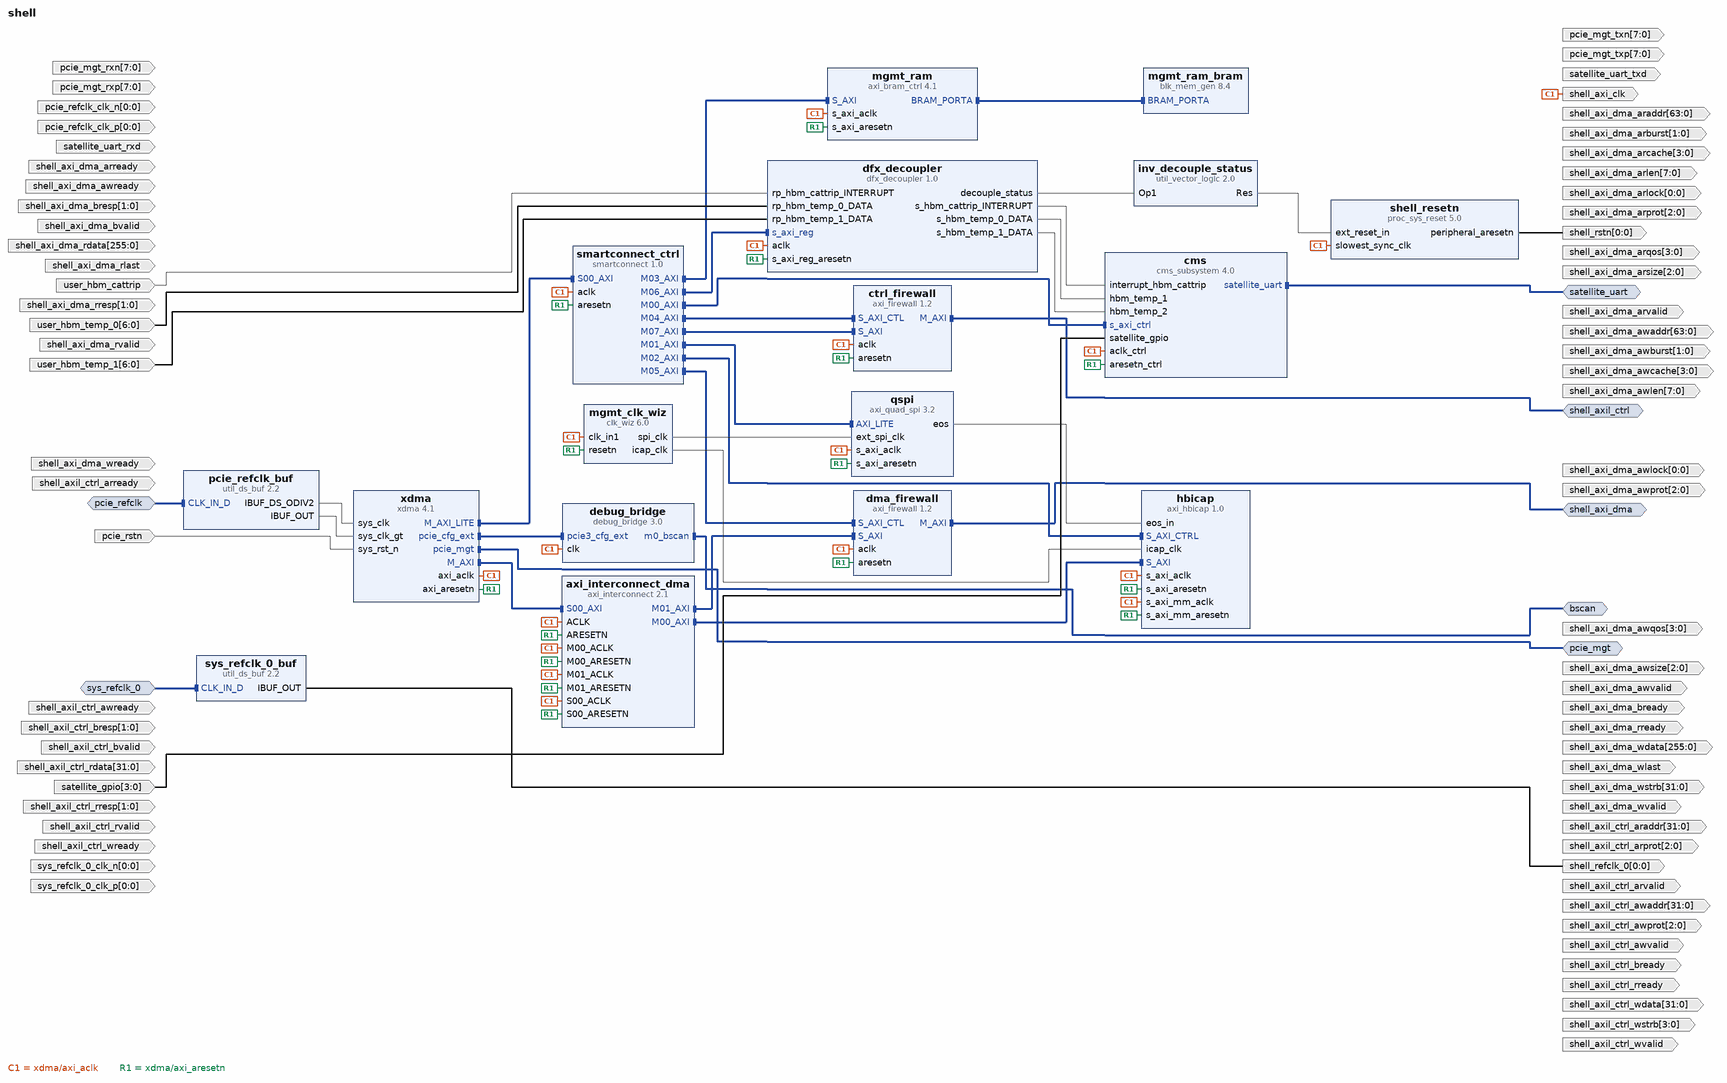
[diagram p0: block diagram of the top level]
# Vivado block design shell, xcu55n-fsvh2892-2L-e, Vivado 2022.2
create_bd_design shell

create_bd_intf_port -mode Master -vlnv xilinx.com:interface:pcie_7x_mgt_rtl:1.0 pcie_mgt
create_bd_intf_port -mode Slave -vlnv xilinx.com:interface:diff_clock_rtl:1.0 pcie_refclk
create_bd_intf_port -mode Master -vlnv xilinx.com:interface:uart_rtl:1.0 satellite_uart
create_bd_intf_port -mode Master -vlnv xilinx.com:interface:aximm_rtl:1.0 shell_axi_dma
set_property -dict [list \
  CONFIG.ADDR_WIDTH 64 \
  CONFIG.DATA_WIDTH 256 \
  CONFIG.HAS_QOS 1 \
  CONFIG.HAS_REGION 0 \
  CONFIG.NUM_READ_OUTSTANDING 32 \
  CONFIG.NUM_WRITE_OUTSTANDING 16 \
  CONFIG.PROTOCOL AXI4 \
] [get_bd_intf_ports shell_axi_dma]
create_bd_intf_port -mode Master -vlnv xilinx.com:interface:aximm_rtl:1.0 shell_axil_ctrl
set_property -dict [list \
  CONFIG.ADDR_WIDTH 32 \
  CONFIG.DATA_WIDTH 32 \
  CONFIG.HAS_BRESP 1 \
  CONFIG.HAS_BURST 0 \
  CONFIG.HAS_CACHE 0 \
  CONFIG.HAS_LOCK 0 \
  CONFIG.HAS_PROT 1 \
  CONFIG.HAS_QOS 0 \
  CONFIG.HAS_REGION 0 \
  CONFIG.HAS_RRESP 1 \
  CONFIG.PROTOCOL AXI4LITE \
] [get_bd_intf_ports shell_axil_ctrl]
create_bd_intf_port -mode Slave -vlnv xilinx.com:interface:diff_clock_rtl:1.0 sys_refclk_0
create_bd_intf_port -mode Master -vlnv xilinx.com:interface:bscan_rtl:1.0 bscan
create_bd_port -dir I -from 7 -to 0 pcie_mgt_rxn
create_bd_port -dir I -from 7 -to 0 pcie_mgt_rxp
create_bd_port -dir O -from 7 -to 0 pcie_mgt_txn
create_bd_port -dir O -from 7 -to 0 pcie_mgt_txp
create_bd_port -dir I -from 0 -to 0 pcie_refclk_clk_p
create_bd_port -dir I -from 0 -to 0 pcie_refclk_clk_n
create_bd_port -dir I satellite_uart_rxd
create_bd_port -dir O satellite_uart_txd
create_bd_port -dir O -from 63 -to 0 shell_axi_dma_araddr
create_bd_port -dir O -from 1 -to 0 shell_axi_dma_arburst
create_bd_port -dir O -from 3 -to 0 shell_axi_dma_arcache
create_bd_port -dir O -from 7 -to 0 shell_axi_dma_arlen
create_bd_port -dir O -from 0 -to 0 shell_axi_dma_arlock
create_bd_port -dir O -from 2 -to 0 shell_axi_dma_arprot
create_bd_port -dir O -from 3 -to 0 shell_axi_dma_arqos
create_bd_port -dir I shell_axi_dma_arready
create_bd_port -dir O -from 2 -to 0 shell_axi_dma_arsize
create_bd_port -dir O shell_axi_dma_arvalid
create_bd_port -dir O -from 63 -to 0 shell_axi_dma_awaddr
create_bd_port -dir O -from 1 -to 0 shell_axi_dma_awburst
create_bd_port -dir O -from 3 -to 0 shell_axi_dma_awcache
create_bd_port -dir O -from 7 -to 0 shell_axi_dma_awlen
create_bd_port -dir O -from 0 -to 0 shell_axi_dma_awlock
create_bd_port -dir O -from 2 -to 0 shell_axi_dma_awprot
create_bd_port -dir O -from 3 -to 0 shell_axi_dma_awqos
create_bd_port -dir I shell_axi_dma_awready
create_bd_port -dir O -from 2 -to 0 shell_axi_dma_awsize
create_bd_port -dir O shell_axi_dma_awvalid
create_bd_port -dir O shell_axi_dma_bready
create_bd_port -dir I -from 1 -to 0 shell_axi_dma_bresp
create_bd_port -dir I shell_axi_dma_bvalid
create_bd_port -dir I -from 255 -to 0 shell_axi_dma_rdata
create_bd_port -dir I shell_axi_dma_rlast
create_bd_port -dir O shell_axi_dma_rready
create_bd_port -dir I -from 1 -to 0 shell_axi_dma_rresp
create_bd_port -dir I shell_axi_dma_rvalid
create_bd_port -dir O -from 255 -to 0 shell_axi_dma_wdata
create_bd_port -dir O shell_axi_dma_wlast
create_bd_port -dir I shell_axi_dma_wready
create_bd_port -dir O -from 31 -to 0 shell_axi_dma_wstrb
create_bd_port -dir O shell_axi_dma_wvalid
create_bd_port -dir O -from 31 -to 0 shell_axil_ctrl_araddr
create_bd_port -dir O -from 2 -to 0 shell_axil_ctrl_arprot
create_bd_port -dir I shell_axil_ctrl_arready
create_bd_port -dir O shell_axil_ctrl_arvalid
create_bd_port -dir O -from 31 -to 0 shell_axil_ctrl_awaddr
create_bd_port -dir O -from 2 -to 0 shell_axil_ctrl_awprot
create_bd_port -dir I shell_axil_ctrl_awready
create_bd_port -dir O shell_axil_ctrl_awvalid
create_bd_port -dir O shell_axil_ctrl_bready
create_bd_port -dir I -from 1 -to 0 shell_axil_ctrl_bresp
create_bd_port -dir I shell_axil_ctrl_bvalid
create_bd_port -dir I -from 31 -to 0 shell_axil_ctrl_rdata
create_bd_port -dir O shell_axil_ctrl_rready
create_bd_port -dir I -from 1 -to 0 shell_axil_ctrl_rresp
create_bd_port -dir I shell_axil_ctrl_rvalid
create_bd_port -dir O -from 31 -to 0 shell_axil_ctrl_wdata
create_bd_port -dir I shell_axil_ctrl_wready
create_bd_port -dir O -from 3 -to 0 shell_axil_ctrl_wstrb
create_bd_port -dir O shell_axil_ctrl_wvalid
create_bd_port -dir I -from 0 -to 0 sys_refclk_0_clk_p
create_bd_port -dir I -from 0 -to 0 sys_refclk_0_clk_n
create_bd_port -dir I -type rst pcie_rstn
create_bd_port -dir I -from 3 -to 0 -type intr satellite_gpio
set_property -dict {CONFIG.PortWidth 4 CONFIG.SENSITIVITY EDGE_RISING} [get_bd_ports satellite_gpio]
create_bd_port -dir O -type clk shell_axi_clk
set_property -dict [list \
  CONFIG.ASSOCIATED_BUSIF shell_axi_dma:shell_axil_ctrl \
  CONFIG.ASSOCIATED_RESET shell_rstn \
] [get_bd_ports shell_axi_clk]
create_bd_port -dir O -from 0 -to 0 -type clk shell_refclk_0
create_bd_port -dir O -from 0 -to 0 -type rst shell_rstn
create_bd_port -dir I -type intr user_hbm_cattrip
create_bd_port -dir I -from 6 -to 0 user_hbm_temp_0
create_bd_port -dir I -from 6 -to 0 user_hbm_temp_1

create_bd_cell -type ip -vlnv xilinx.com:ip:cms_subsystem:4.0 cms
create_bd_cell -type ip -vlnv xilinx.com:ip:axi_firewall:1.2 ctrl_firewall
set_property -dict [list \
  CONFIG.ENABLE_PRESCALER 1 \
  CONFIG.ENABLE_PROTOCOL_CHECKS 1 \
  CONFIG.FIREWALL_MODE MI_SIDE \
  CONFIG.HAS_ARESETN 1 \
] [get_bd_cells ctrl_firewall]
create_bd_cell -type ip -vlnv xilinx.com:ip:debug_bridge:3.0 debug_bridge
set_property -dict {CONFIG.C_BSCAN_MUX 2 CONFIG.C_DEBUG_MODE 5 CONFIG.C_DESIGN_TYPE 0} [get_bd_cells debug_bridge]
create_bd_cell -type ip -vlnv xilinx.com:ip:dfx_decoupler:1.0 dfx_decoupler
set_property -dict [list \
  CONFIG.ALL_PARAMS {['HAS_AXI_LITE 1', 'INTF {', 'hbm_cattrip {ID 0 VLNV xilinx.com:signal:interrupt_rtl:1.0 SIGNALS {INTERRUPT {PRESENT 1 WIDTH 1}}} hbm_temp_0 {ID 1 VLNV xilinx.com:signal:data_rtl:1.0 SIGNALS {DATA {PRESENT 1 WIDTH 7}}} hbm_temp_1', '{ID 2 VLNV xilinx.com:signal:data_rtl:1.0 SIGNALS {DATA {PRESENT 1 WIDTH 7}}}', '}', 'HAS_SIGNAL_CONTROL 0', 'HAS_SIGNAL_STATUS 1', 'IPI_PROP_COUNT 0']} \
  CONFIG.GUI_INTERFACE_NAME hbm_cattrip \
  CONFIG.GUI_SELECT_VLNV xilinx.com:signal:interrupt_rtl:1.0 \
] [get_bd_cells dfx_decoupler]
create_bd_cell -type ip -vlnv xilinx.com:ip:axi_firewall:1.2 dma_firewall
set_property -dict {CONFIG.ENABLE_PRESCALER 1} [get_bd_cells dma_firewall]
create_bd_cell -type ip -vlnv xilinx.com:ip:axi_hbicap:1.0 hbicap
set_property -dict [list \
  CONFIG.C_ICAP_EXTERNAL 0 \
  CONFIG.C_INCLUDE_STARTUP 0 \
  CONFIG.C_READ_PATH 0 \
  CONFIG.C_WRITE_FIFO_DEPTH 1024 \
] [get_bd_cells hbicap]
create_bd_cell -type ip -vlnv xilinx.com:ip:util_vector_logic:2.0 inv_decouple_status
set_property -dict {CONFIG.C_OPERATION not CONFIG.C_SIZE 1} [get_bd_cells inv_decouple_status]
create_bd_cell -type ip -vlnv xilinx.com:ip:clk_wiz:6.0 mgmt_clk_wiz
set_property -dict [list \
  CONFIG.AXI_DRP false \
  CONFIG.CLKOUT1_JITTER 102.484 \
  CONFIG.CLKOUT1_PHASE_ERROR 79.008 \
  CONFIG.CLKOUT1_REQUESTED_OUT_FREQ 100 \
  CONFIG.CLKOUT2_JITTER 98.122 \
  CONFIG.CLKOUT2_PHASE_ERROR 79.008 \
  CONFIG.CLKOUT2_REQUESTED_OUT_FREQ 125 \
  CONFIG.CLKOUT2_USED true \
  CONFIG.CLK_OUT1_PORT spi_clk \
  CONFIG.CLK_OUT2_PORT icap_clk \
  CONFIG.MMCM_CLKFBOUT_MULT_F 5.000 \
  CONFIG.MMCM_CLKOUT0_DIVIDE_F 12.500 \
  CONFIG.MMCM_CLKOUT1_DIVIDE 10 \
  CONFIG.MMCM_DIVCLK_DIVIDE 1 \
  CONFIG.NUM_OUT_CLKS 2 \
  CONFIG.PHASE_DUTY_CONFIG false \
  CONFIG.RESET_PORT resetn \
  CONFIG.RESET_TYPE ACTIVE_LOW \
  CONFIG.USE_DYN_RECONFIG false \
] [get_bd_cells mgmt_clk_wiz]
create_bd_cell -type ip -vlnv xilinx.com:ip:axi_bram_ctrl:4.1 mgmt_ram
set_property -dict {CONFIG.PROTOCOL AXI4LITE CONFIG.SINGLE_PORT_BRAM 1} [get_bd_cells mgmt_ram]
create_bd_cell -type ip -vlnv xilinx.com:ip:blk_mem_gen:8.4 mgmt_ram_bram
create_bd_cell -type ip -vlnv xilinx.com:ip:util_ds_buf:2.2 pcie_refclk_buf
set_property -dict {CONFIG.C_BUF_TYPE IBUFDSGTE} [get_bd_cells pcie_refclk_buf]
create_bd_cell -type ip -vlnv xilinx.com:ip:axi_quad_spi:3.2 qspi
set_property -dict [list \
  CONFIG.C_FIFO_DEPTH 256 \
  CONFIG.C_SPI_MEMORY 2 \
  CONFIG.C_SPI_MODE 2 \
  CONFIG.C_USE_STARTUP 1 \
  CONFIG.C_USE_STARTUP_INT 1 \
] [get_bd_cells qspi]
create_bd_cell -type ip -vlnv xilinx.com:ip:proc_sys_reset:5.0 shell_resetn
create_bd_cell -type ip -vlnv xilinx.com:ip:smartconnect:1.0 smartconnect_ctrl
set_property -dict {CONFIG.NUM_MI 8 CONFIG.NUM_SI 1} [get_bd_cells smartconnect_ctrl]
create_bd_cell -type ip -vlnv xilinx.com:ip:util_ds_buf:2.2 sys_refclk_0_buf
create_bd_cell -type ip -vlnv xilinx.com:ip:xdma:4.1 xdma
set_property -dict [list \
  CONFIG.axi_data_width 256_bit \
  CONFIG.axilite_master_en true \
  CONFIG.axilite_master_size 128 \
  CONFIG.cfg_ext_if true \
  CONFIG.cfg_mgmt_if false \
  CONFIG.pcie_blk_locn PCIE4C_X1Y1 \
  CONFIG.pf0_Use_Class_Code_Lookup_Assistant true \
  CONFIG.pf0_base_class_menu Processing_accelerators \
  CONFIG.pl_link_cap_max_link_speed 16.0_GT/s \
  CONFIG.pl_link_cap_max_link_width X4 \
] [get_bd_cells xdma]
create_bd_cell -type ip -vlnv xilinx.com:ip:axi_interconnect:2.1 axi_interconnect_dma
set_property -dict [list \
  CONFIG.ENABLE_ADVANCED_OPTIONS 0 \
  CONFIG.S00_HAS_DATA_FIFO 0 \
  CONFIG.STRATEGY 0 \
] [get_bd_cells axi_interconnect_dma]

# ---- connections ----

connect_bd_intf_net -intf_net CLK_IN_D_0_1 [get_bd_intf_ports pcie_refclk] [get_bd_intf_pins pcie_refclk_buf/CLK_IN_D]
connect_bd_intf_net [get_bd_intf_pins axi_interconnect_dma/S00_AXI] [get_bd_intf_pins xdma/M_AXI]
connect_bd_intf_net [get_bd_intf_pins axi_interconnect_dma/M00_AXI] [get_bd_intf_pins hbicap/S_AXI]
connect_bd_intf_net [get_bd_intf_pins axi_interconnect_dma/M01_AXI] [get_bd_intf_pins dma_firewall/S_AXI]
connect_bd_intf_net [get_bd_intf_ports bscan] [get_bd_intf_pins debug_bridge/m0_bscan]
connect_bd_intf_net [get_bd_intf_ports satellite_uart] [get_bd_intf_pins cms/satellite_uart]
connect_bd_intf_net [get_bd_intf_ports shell_axil_ctrl] [get_bd_intf_pins ctrl_firewall/M_AXI]
connect_bd_intf_net [get_bd_intf_ports shell_axi_dma] [get_bd_intf_pins dma_firewall/M_AXI]
connect_bd_intf_net [get_bd_intf_pins mgmt_ram/BRAM_PORTA] [get_bd_intf_pins mgmt_ram_bram/BRAM_PORTA]
connect_bd_intf_net [get_bd_intf_pins cms/s_axi_ctrl] [get_bd_intf_pins smartconnect_ctrl/M00_AXI]
connect_bd_intf_net [get_bd_intf_pins qspi/AXI_LITE] [get_bd_intf_pins smartconnect_ctrl/M01_AXI]
connect_bd_intf_net [get_bd_intf_pins hbicap/S_AXI_CTRL] [get_bd_intf_pins smartconnect_ctrl/M02_AXI]
connect_bd_intf_net [get_bd_intf_pins mgmt_ram/S_AXI] [get_bd_intf_pins smartconnect_ctrl/M03_AXI]
connect_bd_intf_net [get_bd_intf_pins ctrl_firewall/S_AXI_CTL] [get_bd_intf_pins smartconnect_ctrl/M04_AXI]
connect_bd_intf_net [get_bd_intf_pins dma_firewall/S_AXI_CTL] [get_bd_intf_pins smartconnect_ctrl/M05_AXI]
connect_bd_intf_net [get_bd_intf_pins dfx_decoupler/s_axi_reg] [get_bd_intf_pins smartconnect_ctrl/M06_AXI]
connect_bd_intf_net [get_bd_intf_pins ctrl_firewall/S_AXI] [get_bd_intf_pins smartconnect_ctrl/M07_AXI]
connect_bd_intf_net [get_bd_intf_ports sys_refclk_0] [get_bd_intf_pins sys_refclk_0_buf/CLK_IN_D]
connect_bd_intf_net [get_bd_intf_pins smartconnect_ctrl/S00_AXI] [get_bd_intf_pins xdma/M_AXI_LITE]
connect_bd_intf_net [get_bd_intf_pins debug_bridge/pcie3_cfg_ext] [get_bd_intf_pins xdma/pcie_cfg_ext]
connect_bd_intf_net [get_bd_intf_ports pcie_mgt] [get_bd_intf_pins xdma/pcie_mgt]
connect_bd_net -net decouple_status [get_bd_pins dfx_decoupler/decouple_status] [get_bd_pins inv_decouple_status/Op1]
connect_bd_net -net eos [get_bd_pins qspi/eos] [get_bd_pins hbicap/eos_in]
connect_bd_net -net hbm_cattrip [get_bd_pins dfx_decoupler/s_hbm_cattrip_INTERRUPT] [get_bd_pins cms/interrupt_hbm_cattrip]
connect_bd_net -net hbm_temp_0 [get_bd_pins dfx_decoupler/s_hbm_temp_0_DATA] [get_bd_pins cms/hbm_temp_1]
connect_bd_net -net hbm_temp_1 [get_bd_pins dfx_decoupler/s_hbm_temp_1_DATA] [get_bd_pins cms/hbm_temp_2]
connect_bd_net -net icap_clk [get_bd_pins mgmt_clk_wiz/icap_clk] [get_bd_pins hbicap/icap_clk]
connect_bd_net -net inv_decouple_status [get_bd_pins inv_decouple_status/Res] [get_bd_pins shell_resetn/ext_reset_in]
connect_bd_net [get_bd_pins pcie_refclk_buf/IBUF_DS_ODIV2] [get_bd_pins xdma/sys_clk]
connect_bd_net [get_bd_pins pcie_refclk_buf/IBUF_OUT] [get_bd_pins xdma/sys_clk_gt]
connect_bd_net [get_bd_ports pcie_rstn] [get_bd_pins xdma/sys_rst_n]
connect_bd_net [get_bd_ports satellite_gpio] [get_bd_pins cms/satellite_gpio]
connect_bd_net -net shell_refclk_0 [get_bd_pins sys_refclk_0_buf/IBUF_OUT] [get_bd_ports shell_refclk_0]
connect_bd_net [get_bd_pins shell_resetn/peripheral_aresetn] [get_bd_ports shell_rstn]
connect_bd_net -net spi_clk [get_bd_pins mgmt_clk_wiz/spi_clk] [get_bd_pins qspi/ext_spi_clk]
connect_bd_net [get_bd_ports user_hbm_cattrip] [get_bd_pins dfx_decoupler/rp_hbm_cattrip_INTERRUPT]
connect_bd_net [get_bd_ports user_hbm_temp_0] [get_bd_pins dfx_decoupler/rp_hbm_temp_0_DATA]
connect_bd_net [get_bd_ports user_hbm_temp_1] [get_bd_pins dfx_decoupler/rp_hbm_temp_1_DATA]
connect_bd_net [get_bd_pins xdma/axi_aclk] \
  [get_bd_ports shell_axi_clk] [get_bd_pins cms/aclk_ctrl] [get_bd_pins ctrl_firewall/aclk] [get_bd_pins debug_bridge/clk] \
  [get_bd_pins dfx_decoupler/aclk] [get_bd_pins dma_firewall/aclk] [get_bd_pins hbicap/s_axi_aclk] \
  [get_bd_pins hbicap/s_axi_mm_aclk] [get_bd_pins mgmt_clk_wiz/clk_in1] [get_bd_pins mgmt_ram/s_axi_aclk] \
  [get_bd_pins qspi/s_axi_aclk] [get_bd_pins shell_resetn/slowest_sync_clk] [get_bd_pins smartconnect_ctrl/aclk] \
  [get_bd_pins axi_interconnect_dma/ACLK] [get_bd_pins axi_interconnect_dma/S00_ACLK] \
  [get_bd_pins axi_interconnect_dma/M00_ACLK] [get_bd_pins axi_interconnect_dma/M01_ACLK]
connect_bd_net [get_bd_pins xdma/axi_aresetn] \
  [get_bd_pins cms/aresetn_ctrl] [get_bd_pins ctrl_firewall/aresetn] [get_bd_pins dfx_decoupler/s_axi_reg_aresetn] \
  [get_bd_pins dma_firewall/aresetn] [get_bd_pins hbicap/s_axi_aresetn] [get_bd_pins hbicap/s_axi_mm_aresetn] \
  [get_bd_pins mgmt_clk_wiz/resetn] [get_bd_pins mgmt_ram/s_axi_aresetn] [get_bd_pins qspi/s_axi_aresetn] \
  [get_bd_pins smartconnect_ctrl/aresetn] [get_bd_pins axi_interconnect_dma/ARESETN] \
  [get_bd_pins axi_interconnect_dma/S00_ARESETN] [get_bd_pins axi_interconnect_dma/M00_ARESETN] \
  [get_bd_pins axi_interconnect_dma/M01_ARESETN]

# ---- address map ----
assign_bd_address -offset 0x0000000000000000 -range 256T -target_address_space [get_bd_addr_spaces xdma/M_AXI] [get_bd_addr_segs shell_axi_dma/Reg]
assign_bd_address -offset 0x1000000000000000 -range 1G -target_address_space [get_bd_addr_spaces xdma/M_AXI] [get_bd_addr_segs hbicap/S_AXI/Mem0]
assign_bd_address -offset 0x00000000 -range 64M -target_address_space [get_bd_addr_spaces xdma/M_AXI_LITE] [get_bd_addr_segs shell_axil_ctrl/Reg]
assign_bd_address -offset 0x04000000 -range 256K -target_address_space [get_bd_addr_spaces xdma/M_AXI_LITE] [get_bd_addr_segs cms/s_axi_ctrl/Mem]
assign_bd_address -offset 0x04040000 -range 64K -target_address_space [get_bd_addr_spaces xdma/M_AXI_LITE] [get_bd_addr_segs qspi/AXI_LITE/Reg]
assign_bd_address -offset 0x04050000 -range 64K -target_address_space [get_bd_addr_spaces xdma/M_AXI_LITE] [get_bd_addr_segs hbicap/S_AXI_CTRL/Reg0]
assign_bd_address -offset 0x04060000 -range 4K -target_address_space [get_bd_addr_spaces xdma/M_AXI_LITE] [get_bd_addr_segs mgmt_ram/S_AXI/Mem0]
assign_bd_address -offset 0x04070000 -range 64K -target_address_space [get_bd_addr_spaces xdma/M_AXI_LITE] [get_bd_addr_segs ctrl_firewall/S_AXI_CTL/Control]
assign_bd_address -offset 0x04080000 -range 64K -target_address_space [get_bd_addr_spaces xdma/M_AXI_LITE] [get_bd_addr_segs dma_firewall/S_AXI_CTL/Control]
assign_bd_address -offset 0x04090000 -range 64K -target_address_space [get_bd_addr_spaces xdma/M_AXI_LITE] [get_bd_addr_segs dfx_decoupler/s_axi_reg/Reg]

validate_bd_design
save_bd_design
